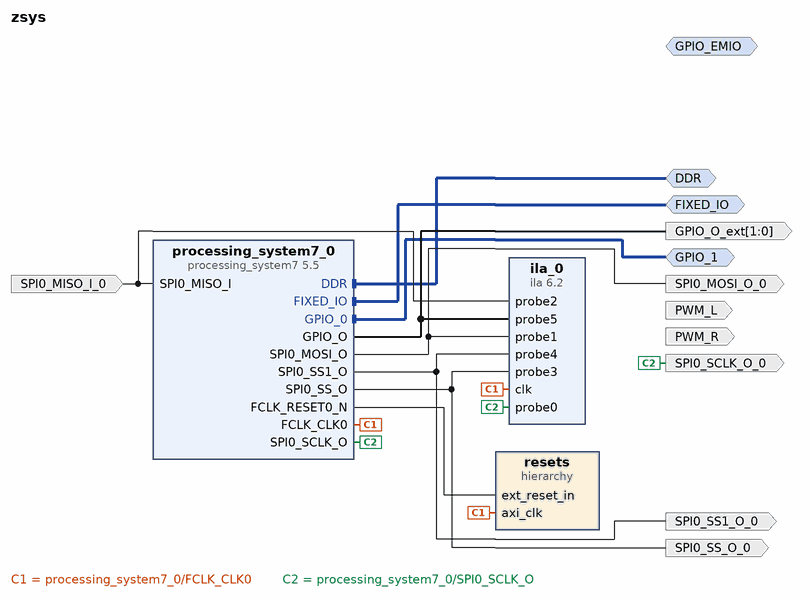
[diagram p0: block diagram of the top level]
# Vivado block design zsys, xc7z010clg225-1, Vivado 2024.2
create_bd_design zsys

create_bd_intf_port -mode Master -vlnv xilinx.com:interface:ddrx_rtl:1.0 DDR
create_bd_intf_port -mode Master -vlnv xilinx.com:display_processing_system7:fixedio_rtl:1.0 FIXED_IO
create_bd_intf_port -mode Master -vlnv xilinx.com:interface:gpio_rtl:1.0 GPIO_1
create_bd_intf_port -mode Master -vlnv xilinx.com:interface:gpio_rtl:1.0 GPIO_EMIO
create_bd_port -dir O PWM_L
create_bd_port -dir O PWM_R
create_bd_port -dir O SPI0_MOSI_O_0
create_bd_port -dir I SPI0_MISO_I_0
create_bd_port -dir O SPI0_SCLK_O_0
create_bd_port -dir O SPI0_SS_O_0
create_bd_port -dir O SPI0_SS1_O_0
create_bd_port -dir O -from 1 -to 0 GPIO_O_ext

create_bd_cell -type ip -vlnv xilinx.com:ip:processing_system7:5.5 processing_system7_0
set_property -dict [list \
  CONFIG.PCW_CRYSTAL_PERIPHERAL_FREQMHZ 33.33333 \
  CONFIG.PCW_FPGA0_PERIPHERAL_FREQMHZ 160 \
  CONFIG.PCW_FPGA1_PERIPHERAL_FREQMHZ 16.384 \
  CONFIG.PCW_FPGA2_PERIPHERAL_FREQMHZ 200 \
  CONFIG.PCW_FPGA3_PERIPHERAL_FREQMHZ 12.228 \
  CONFIG.PCW_GPIO_EMIO_GPIO_ENABLE 1 \
  CONFIG.PCW_GPIO_EMIO_GPIO_IO 2 \
  CONFIG.PCW_GPIO_EMIO_GPIO_WIDTH 2 \
  CONFIG.PCW_GPIO_MIO_GPIO_ENABLE 1 \
  CONFIG.PCW_GPIO_MIO_GPIO_IO MIO \
  CONFIG.PCW_I2C1_I2C1_IO {MIO 48 .. 49} \
  CONFIG.PCW_I2C1_PERIPHERAL_ENABLE 1 \
  CONFIG.PCW_I2C_PERIPHERAL_FREQMHZ 111.111107 \
  CONFIG.PCW_I2C_RESET_ENABLE 0 \
  CONFIG.PCW_IRQ_F2P_INTR 1 \
  CONFIG.PCW_PRESET_BANK1_VOLTAGE {LVCMOS 3.3V} \
  CONFIG.PCW_QSPI_GRP_SINGLE_SS_ENABLE 1 \
  CONFIG.PCW_QSPI_GRP_SINGLE_SS_IO {MIO 1 .. 6} \
  CONFIG.PCW_QSPI_PERIPHERAL_ENABLE 1 \
  CONFIG.PCW_QSPI_QSPI_IO {MIO 1 .. 6} \
  CONFIG.PCW_SD1_GRP_CD_ENABLE 1 \
  CONFIG.PCW_SD1_GRP_CD_IO 0 \
  CONFIG.PCW_SD1_PERIPHERAL_ENABLE 1 \
  CONFIG.PCW_SD1_SD1_IO {MIO 10 .. 15} \
  CONFIG.PCW_SDIO_PERIPHERAL_FREQMHZ 100 \
  CONFIG.PCW_SINGLE_QSPI_DATA_MODE x4 \
  CONFIG.PCW_SPI0_PERIPHERAL_ENABLE 1 \
  CONFIG.PCW_SPI0_SPI0_IO EMIO \
  CONFIG.PCW_UART1_PERIPHERAL_ENABLE 1 \
  CONFIG.PCW_UART1_UART1_IO {MIO 8 .. 9} \
  CONFIG.PCW_UART_PERIPHERAL_FREQMHZ 100 \
  CONFIG.PCW_UIPARAM_DDR_MEMORY_TYPE {DDR 3 (Low Voltage)} \
  CONFIG.PCW_UIPARAM_DDR_PARTNO {MT41J256M16 RE-125} \
  CONFIG.PCW_USB0_PERIPHERAL_ENABLE 1 \
  CONFIG.PCW_USB0_RESET_ENABLE 1 \
  CONFIG.PCW_USB0_RESET_IO {MIO 7} \
  CONFIG.PCW_USB0_USB0_IO {MIO 28 .. 39} \
  CONFIG.PCW_USB_RESET_ENABLE 1 \
  CONFIG.PCW_USB_RESET_SELECT {Share reset pin} \
  CONFIG.PCW_USE_FABRIC_INTERRUPT 1 \
  CONFIG.PCW_USE_M_AXI_GP0 0 \
  CONFIG.PCW_WDT_PERIPHERAL_ENABLE 1 \
  CONFIG.PCW_WDT_WDT_IO EMIO \
] [get_bd_cells processing_system7_0]
# 167 more settings of processing_system7_0 are not shown: defaults, MIO pin electricals, DDR timing, and values the tool derives
create_bd_cell -type hier resets
create_bd_cell -type ip -vlnv xilinx.com:ip:ila:6.2 ila_0
set_property -dict {CONFIG.C_DATA_DEPTH 16384 CONFIG.C_MONITOR_TYPE Native CONFIG.C_NUM_OF_PROBES 6} [get_bd_cells ila_0]

# ---- hierarchy /resets ----
current_bd_instance /resets
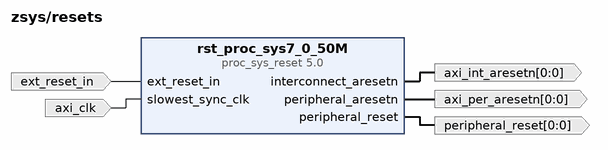
[diagram p1: block diagram inside /resets]
create_bd_pin -dir I -type clk axi_clk
create_bd_pin -dir O -from 0 -to 0 -type rst axi_int_aresetn
create_bd_pin -dir O -from 0 -to 0 -type rst axi_per_aresetn
create_bd_pin -dir I -type rst ext_reset_in
create_bd_pin -dir O -from 0 -to 0 -type rst peripheral_reset

create_bd_cell -type ip -vlnv xilinx.com:ip:proc_sys_reset:5.0 rst_proc_sys7_0_50M

# ---- connections ----

current_bd_instance /resets
connect_bd_net [get_bd_pins ext_reset_in] [get_bd_pins rst_proc_sys7_0_50M/ext_reset_in]
connect_bd_net [get_bd_pins rst_proc_sys7_0_50M/interconnect_aresetn] [get_bd_pins axi_int_aresetn]
connect_bd_net [get_bd_pins rst_proc_sys7_0_50M/peripheral_aresetn] [get_bd_pins axi_per_aresetn]
connect_bd_net [get_bd_pins rst_proc_sys7_0_50M/peripheral_reset] [get_bd_pins peripheral_reset]
connect_bd_net -net slowest_sync_clk_1 [get_bd_pins axi_clk] [get_bd_pins rst_proc_sys7_0_50M/slowest_sync_clk]

current_bd_instance /
connect_bd_intf_net [get_bd_intf_ports DDR] [get_bd_intf_pins processing_system7_0/DDR]
connect_bd_intf_net [get_bd_intf_ports FIXED_IO] [get_bd_intf_pins processing_system7_0/FIXED_IO]
connect_bd_intf_net [get_bd_intf_ports GPIO_1] [get_bd_intf_pins processing_system7_0/GPIO_0]
connect_bd_net -net SPI0_MISO_I_0_1 [get_bd_ports SPI0_MISO_I_0] [get_bd_pins processing_system7_0/SPI0_MISO_I] [get_bd_pins ila_0/probe2]
connect_bd_net [get_bd_pins processing_system7_0/FCLK_CLK0] [get_bd_pins resets/axi_clk] [get_bd_pins ila_0/clk]
connect_bd_net [get_bd_pins processing_system7_0/FCLK_RESET0_N] [get_bd_pins resets/ext_reset_in]
connect_bd_net [get_bd_pins processing_system7_0/GPIO_O] [get_bd_ports GPIO_O_ext] [get_bd_pins ila_0/probe5]
connect_bd_net [get_bd_pins processing_system7_0/SPI0_MOSI_O] [get_bd_ports SPI0_MOSI_O_0] [get_bd_pins ila_0/probe1]
connect_bd_net [get_bd_pins processing_system7_0/SPI0_SCLK_O] [get_bd_ports SPI0_SCLK_O_0] [get_bd_pins ila_0/probe0]
connect_bd_net [get_bd_pins processing_system7_0/SPI0_SS1_O] [get_bd_ports SPI0_SS1_O_0] [get_bd_pins ila_0/probe4]
connect_bd_net [get_bd_pins processing_system7_0/SPI0_SS_O] [get_bd_ports SPI0_SS_O_0] [get_bd_pins ila_0/probe3]

validate_bd_design
save_bd_design
